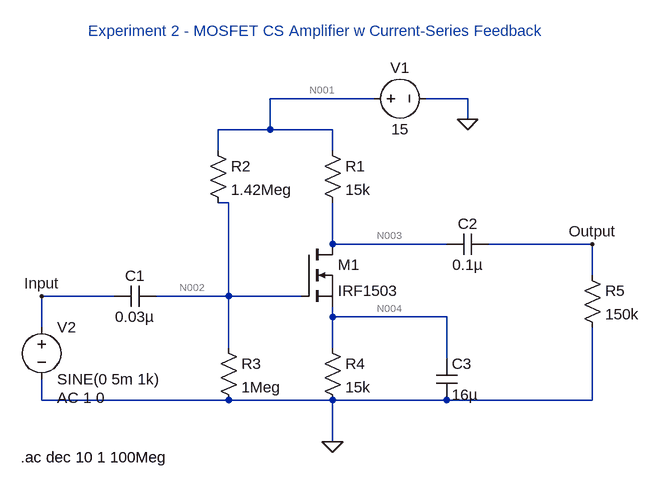
[diagram p0: schematic Experiment 2 - MOSFET CS Amplifier w Current-Series Feedback.asc]
Experiment 2 - MOSFET CS Amplifier w Current-Series Feedback.asc, the LTspice schematic file:
Version 4
SHEET 1 880 680
WIRE 272 -112 112 -112
WIRE 416 -112 352 -112
WIRE 416 -80 416 -112
WIRE 112 -64 112 -112
WIRE 112 -64 32 -64
WIRE 208 -64 112 -64
WIRE 32 -32 32 -64
WIRE 208 -32 208 -64
WIRE 48 48 32 48
WIRE 208 112 208 48
WIRE 384 112 208 112
WIRE 608 112 448 112
WIRE 608 160 608 112
WIRE -128 192 -240 192
WIRE 48 192 48 48
WIRE 48 192 -64 192
WIRE 160 192 48 192
WIRE 208 224 208 208
WIRE 384 224 208 224
WIRE -240 240 -240 192
WIRE 48 272 48 192
WIRE 208 272 208 224
WIRE 384 288 384 224
WIRE -240 352 -240 320
WIRE 48 352 -240 352
WIRE 208 352 48 352
WIRE 384 352 208 352
WIRE 608 352 608 240
WIRE 608 352 384 352
WIRE 208 416 208 352
FLAG 208 416 0
FLAG 416 -80 0
FLAG 608 112 Output
FLAG -240 192 Input
SYMBOL nmos 160 112 R0
SYMATTR InstName M1
SYMATTR Value IRF1503
SYMBOL res 192 256 R0
SYMATTR InstName R4
SYMATTR Value 15k
SYMBOL res 32 256 R0
SYMATTR InstName R3
SYMATTR Value 1Meg
SYMBOL res 16 -48 R0
SYMATTR InstName R2
SYMATTR Value 1.42Meg
SYMBOL res 192 -48 R0
SYMATTR InstName R1
SYMATTR Value 15k
SYMBOL cap 368 288 R0
SYMATTR InstName C3
SYMATTR Value 16µ
SYMBOL cap 448 96 R90
WINDOW 0 0 32 VBottom 2
WINDOW 3 32 32 VTop 2
SYMATTR InstName C2
SYMATTR Value 0.1µ
SYMBOL res 592 144 R0
SYMATTR InstName R5
SYMATTR Value 150k
SYMBOL voltage 256 -112 M90
WINDOW 0 -32 56 VBottom 2
WINDOW 3 32 56 VTop 2
WINDOW 123 0 0 Left 0
WINDOW 39 0 0 Left 0
SYMATTR InstName V1
SYMATTR Value 15
SYMBOL voltage -240 224 R0
WINDOW 123 24 124 Left 2
WINDOW 39 0 0 Left 0
SYMATTR Value2 AC 1 0
SYMATTR InstName V2
SYMATTR Value SINE(0 5m 1k)
SYMBOL cap -64 176 R90
WINDOW 0 0 32 VBottom 2
WINDOW 3 32 32 VTop 2
SYMATTR InstName C1
SYMATTR Value 0.03µ
TEXT -168 -216 Left 2 ;Experiment 2 - MOSFET CS Amplifier w Current-Series Feedback
TEXT -272 440 Left 2 !.ac dec 10 1 100Meg

The netlist it stands for:
* Experiment 2 - MOSFET CS Amplifier w Current-Series Feedback.asc
M1 N003 N002 N004 N004 IRF1503
R4 N004 0 15k
R3 N002 0 1Meg
R2 N001 N002 1.42Meg
R1 N001 N003 15k
C3 N004 0 16µ
C2 Output N003 0.1µ
R5 Output 0 150k
V1 N001 0 15
V2 Input 0 SINE(0 5m 1k) AC 1 0
C1 N002 Input 0.03µ
.model NMOS NMOS
.model PMOS PMOS
.lib standard.mos
* Experiment 2 - MOSFET CS Amplifier w Current-Series Feedback
.ac dec 10 1 100Meg
.backanno
.end

* Results of the author's LTspice run, read from the files saved beside the schematic
* Operating Point, zero values left out:
*   V(n003) = 12.41 V
*   V(n002) = 6.198 V
*   V(n004) = 2.59 V
*   V(n001) = 15 V
*   Id(M1) = 172.6 µA
*   Ig(M1) = -535.3 pA
*   Is(M1) = -172.6 µA
*   I(R1) = 172.6 µA
*   I(R2) = 6.198 µA
*   I(R3) = 6.198 µA
*   I(R4) = 172.6 µA
*   I(V1) = -178.8 µA